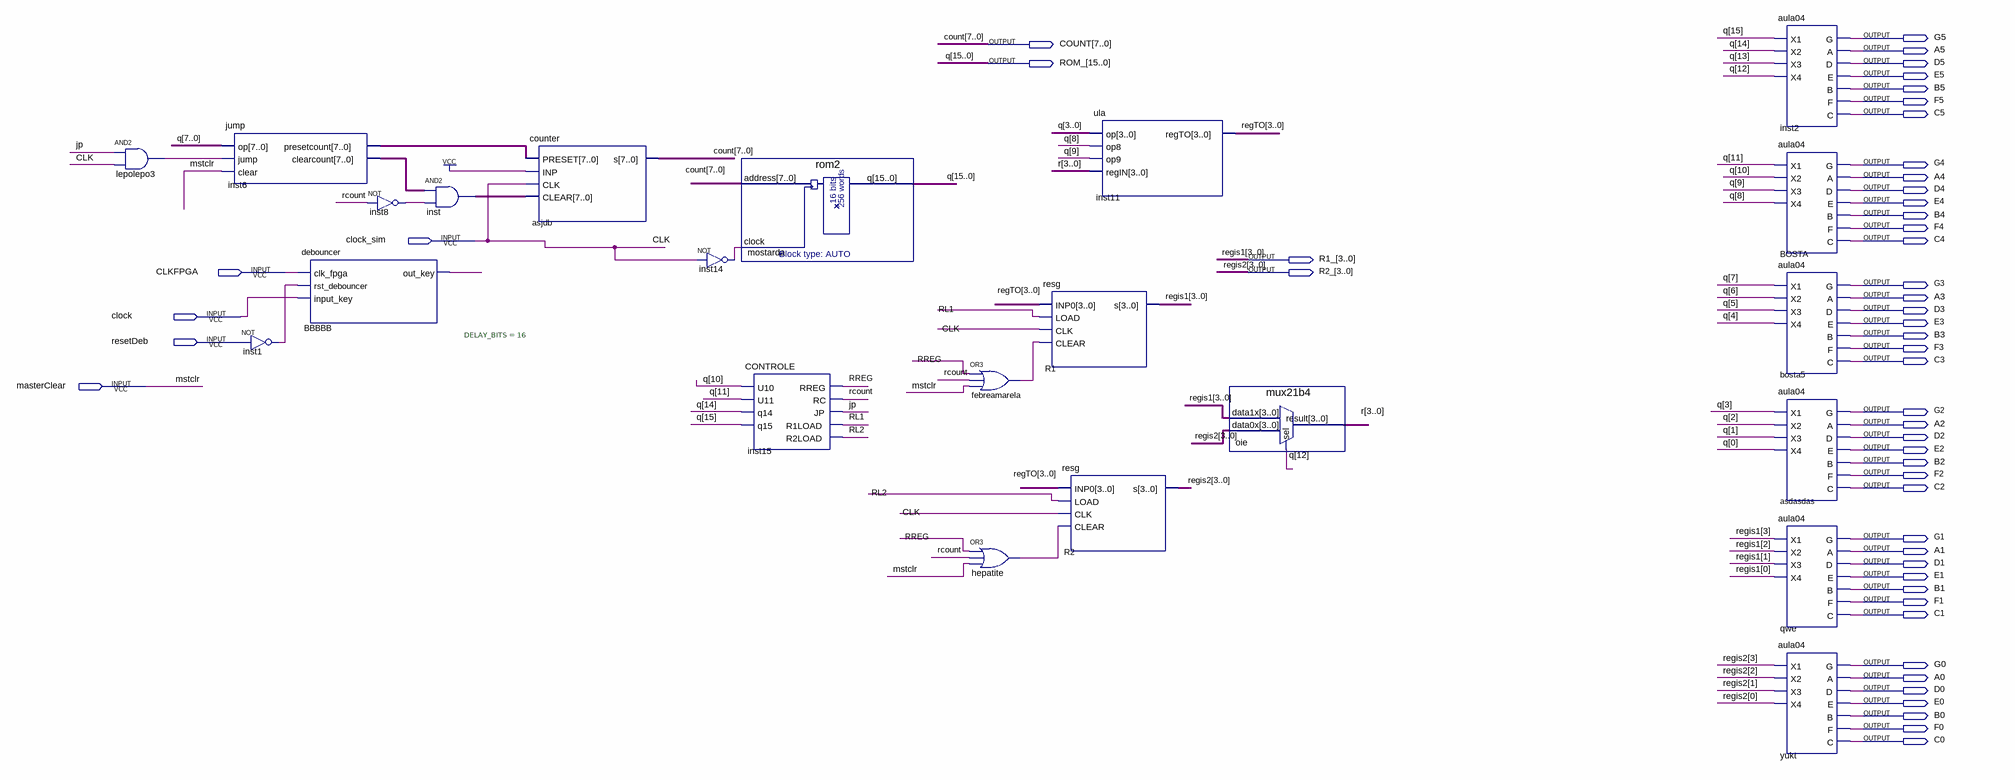
[diagram p0: schematic sheet]
// Quartus schematic cpu.bdf as structural Verilog: 22 symbols, 51 pins
module cpu (
  input  clock_sim,
  input  CLKFPGA,
  input  clock,
  input  resetDeb,
  input  masterClear,
  output G5,
  output [7:0] COUNT,
  output A5,
  output [15:0] ROM_,
  output D5,
  output E5,
  output B5,
  output F5,
  output C5,
  output G4,
  output A4,
  output D4,
  output E4,
  output B4,
  output F4,
  output C4,
  output [3:0] R1_,
  output [3:0] R2_,
  output G3,
  output A3,
  output D3,
  output E3,
  output B3,
  output F3,
  output C3,
  output G2,
  output A2,
  output D2,
  output E2,
  output B2,
  output F2,
  output C2,
  output G1,
  output A1,
  output D1,
  output E1,
  output B1,
  output F1,
  output C1,
  output G0,
  output A0,
  output D0,
  output E0,
  output B0,
  output F0,
  output C0
);

  wire BBBBB_out_key, febreamarela_out, hepatite_out, inst1_out, inst8_out, inst14_out, jp, lepolepo3_out,
       rcount, RL1, RL2, RREG;
  wire [3:0] r, regTO;
  wire [7:0] inst6_clearcount, inst6_presetcount, inst_out;

  and lepolepo3 (lepolepo3_out, jp, clock_sim);
  jump inst6 (
    .op(ROM_[7:0]), .jump(lepolepo3_out), .clear(masterClear), .presetcount(inst6_presetcount),
    .clearcount(inst6_clearcount));
  not inst1 (inst1_out, resetDeb);
  debouncer #(.DELAY_BITS(16)) BBBBB (
    .clk_fpga(CLKFPGA), .rst_debouncer(inst1_out), .input_key(clock), .out_key(BBBBB_out_key));
  not inst8 (inst8_out, rcount);
  assign inst_out = inst6_clearcount & {8{inst8_out}};  // AND2 inst, 8 bits wide
  counter asjdb (.PRESET(inst6_presetcount), .INP(1'b1), .CLK(clock_sim), .CLEAR(inst_out), .s(COUNT));
  rom2 mostarda (.address(COUNT), .clock(inst14_out), .q(ROM_));
  not inst14 (inst14_out, clock_sim);
  CONTROLE inst15 (
    .U10(ROM_[10]), .U11(ROM_[11]), .q14(ROM_[14]), .q15(ROM_[15]), .RREG(RREG), .RC(rcount), .JP(jp),
    .R1LOAD(RL1), .R2LOAD(RL2));
  or febreamarela (febreamarela_out, RREG, rcount, masterClear);
  or hepatite (hepatite_out, RREG, rcount, masterClear);
  resg R1 (.INP0(regTO), .LOAD(RL1), .CLK(clock_sim), .CLEAR(febreamarela_out), .s(R1_));
  ula inst11 (.op(ROM_[3:0]), .op8(ROM_[8]), .op9(ROM_[9]), .regIN(r), .regTO(regTO));
  resg R2 (.INP0(regTO), .LOAD(RL2), .CLK(clock_sim), .CLEAR(hepatite_out), .s(R2_));
  mux21b4 oie (.data1x(R1_), .data0x(R2_), .sel(ROM_[12]), .result(r));
  aula04 inst2 (
    .X1(ROM_[15]), .X2(ROM_[14]), .X3(ROM_[13]), .X4(ROM_[12]), .G(G5), .A(A5), .D(D5), .E(E5), .B(B5),
    .F(F5), .C(C5));
  aula04 BOSTA (
    .X1(ROM_[11]), .X2(ROM_[10]), .X3(ROM_[9]), .X4(ROM_[8]), .G(G4), .A(A4), .D(D4), .E(E4), .B(B4), .F(F4),
    .C(C4));
  aula04 bosta5 (
    .X1(ROM_[7]), .X2(ROM_[6]), .X3(ROM_[5]), .X4(ROM_[4]), .G(G3), .A(A3), .D(D3), .E(E3), .B(B3), .F(F3),
    .C(C3));
  aula04 asdasdas (
    .X1(ROM_[3]), .X2(ROM_[2]), .X3(ROM_[1]), .X4(ROM_[0]), .G(G2), .A(A2), .D(D2), .E(E2), .B(B2), .F(F2),
    .C(C2));
  aula04 qwe (
    .X1(R1_[3]), .X2(R1_[2]), .X3(R1_[1]), .X4(R1_[0]), .G(G1), .A(A1), .D(D1), .E(E1), .B(B1), .F(F1), .C(C1));
  aula04 yukt (
    .X1(R2_[3]), .X2(R2_[2]), .X3(R2_[1]), .X4(R2_[0]), .G(G0), .A(A0), .D(D0), .E(E0), .B(B0), .F(F0), .C(C0));

  // Other names for the same wires on the sheet: CLK = clock_sim; mstclr = masterClear; q[15:0] = ROM_;
  //   regis1[3:0] = R1_; regis2[3:0] = R2_
endmodule
